# EAGLE design Pololu Magnetic Encoder (Floating) (AS5035) (EAGLE 6.4)
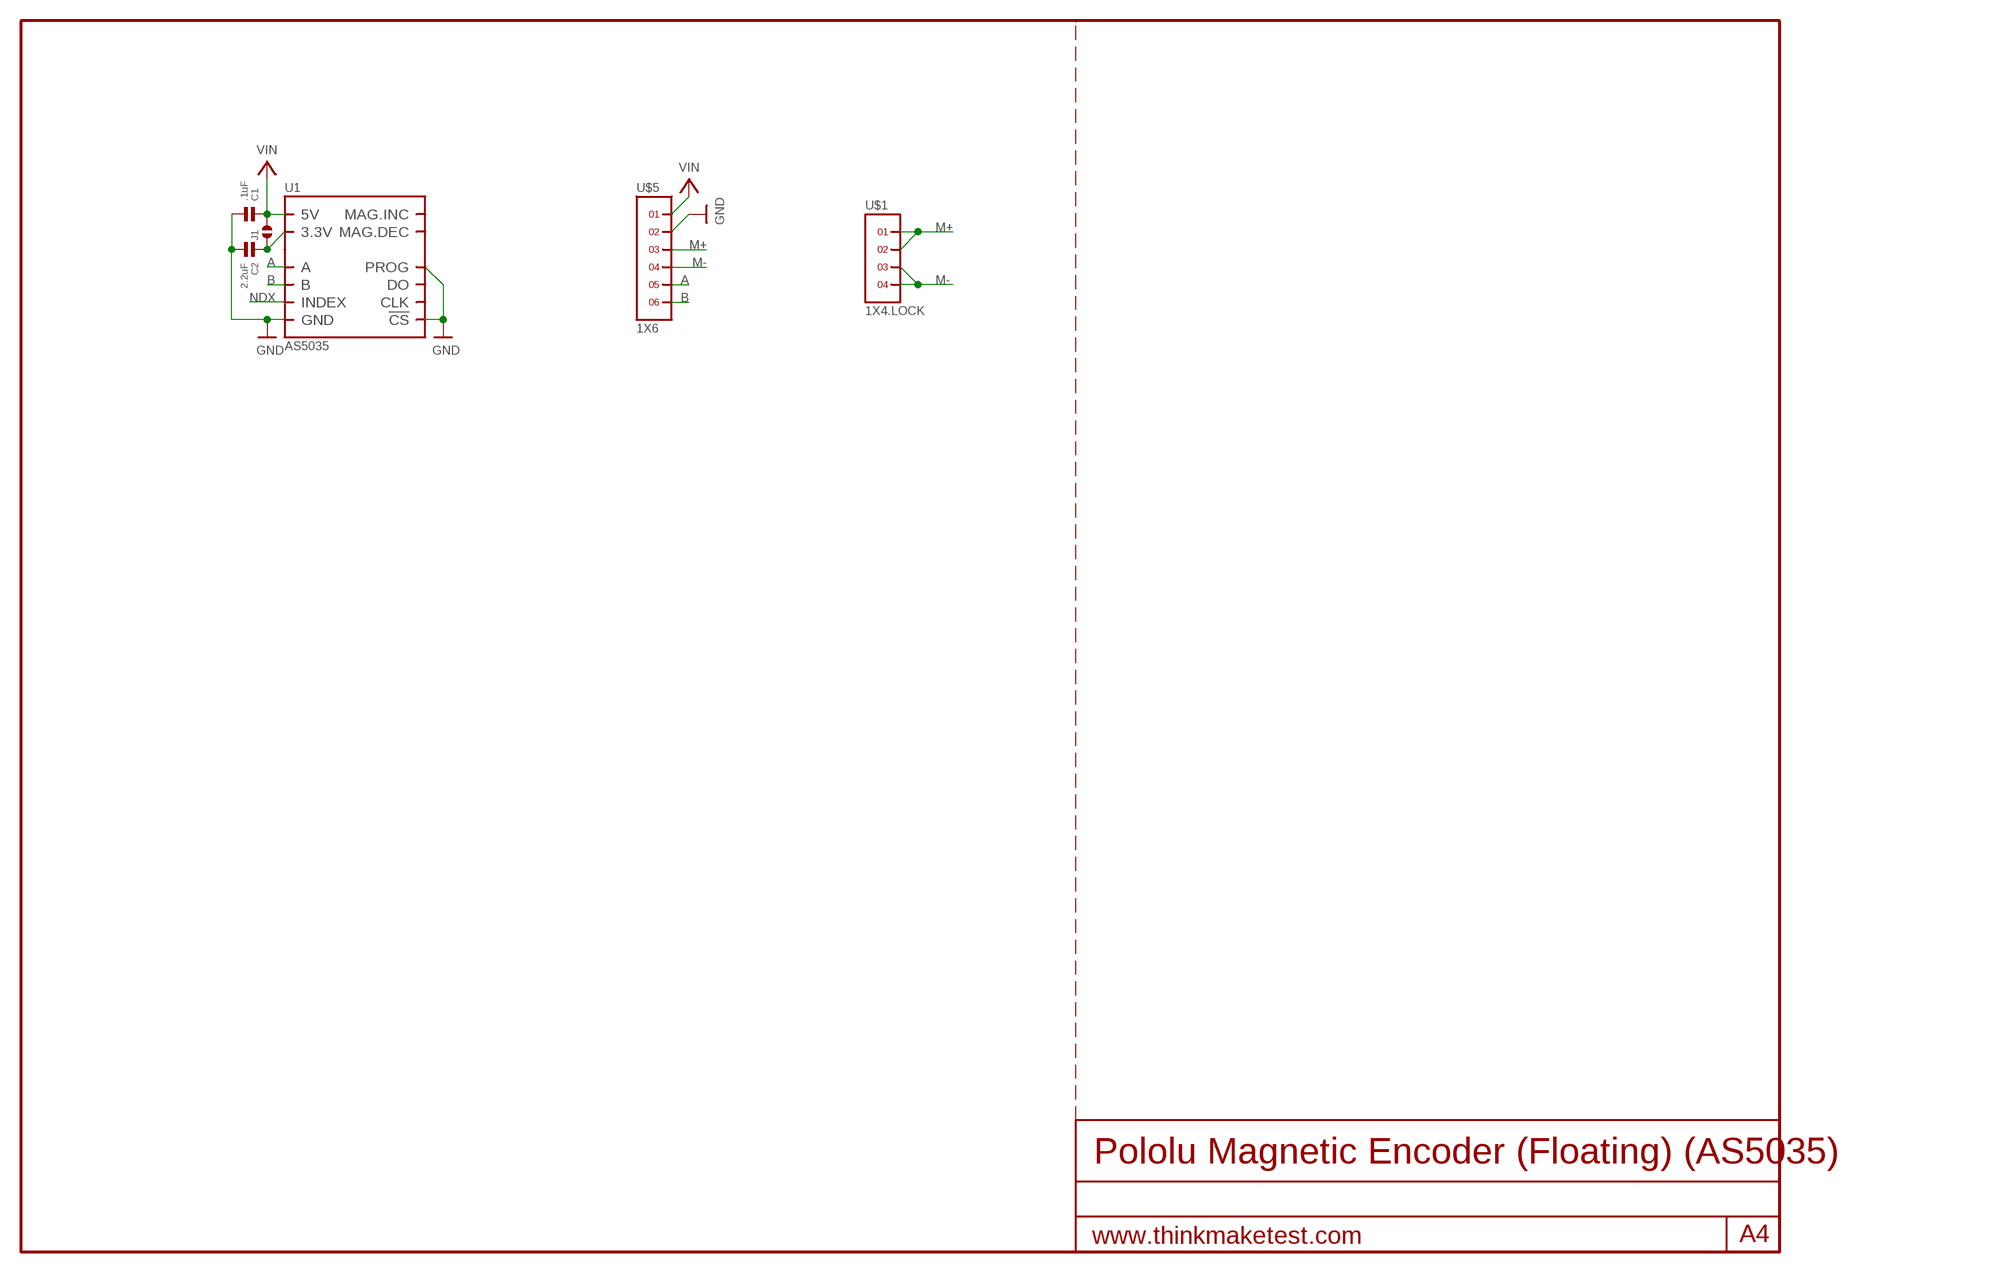
[diagram p0: schematic, sheet 1]

## Parts
C1  .1uF  CAPACITOR.0603  [0603]
C2  2.2uF  CAPACITOR.0603  [0603]
J1  SOLDERJUMPER.2.LRG.PASTE  [2.LRG.PASTE]
U1  AS5035  [SSOP16]
U$1  1X4.LOCK  [1X4.LOCK]
U$5  1X6  [1X6]

## Nets
A: U1.3(A) U$5.5
B: U1.4(B) U$5.6
GND: C1.2 C2.2 U1.7(GND) U1.8(PROG) U1.11(!CS) U$5.2
M+: U$1.1 U$1.2 U$5.3
M-: U$1.3 U$1.4 U$5.4
N$4: C2.1 J1.1 U1.15(3.3V)
NDX: U1.6(INDEX)
VIN: C1.1 J1.2 U1.16(5V) U$5.1
Unconnected: U1.1(MAG.INC) U1.2(MAG.DEC) U1.9(DO) U1.10(CLK)

## Library data of the parts
C1 C2 = .standardparts:CAPACITOR
J1 = .solderjumper:SOLDERJUMPER.2
U1 = austriamicrosystems:AS5035
U$1 = headers(.05in):1X4
U$5 = headers(2mm):1X6

## Board
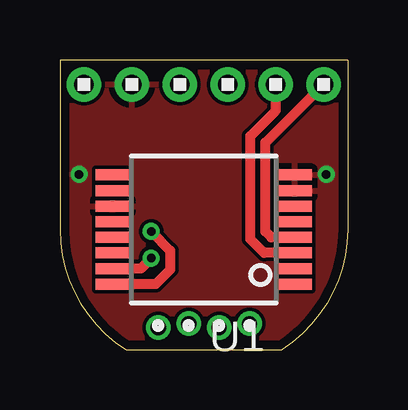
[diagram p1: board, top side]
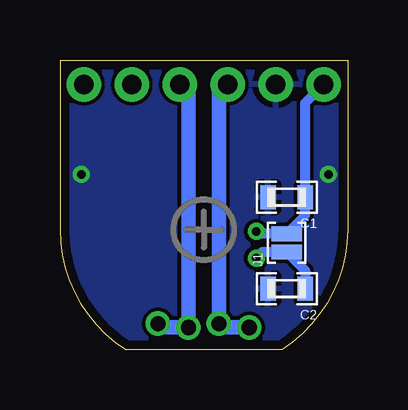
[diagram p2: board, bottom side, seen from below]

Size 12 x 12.06 mm. Coordinates in mm from the lower left corner, seen from the top.
Outline: 2.75,0 9.25,0 arc58 12,5 12,12.06 0,12.06 0,5 arc58 2.75,0
Copper layers (1*16): Top 0.0356mm / dielectric 1.5011mm / Bottom 0.0356mm
Design rules "OSHPark": minimum track width 6mil, minimum drill 13mil, track to track 6mil, track to pad 6mil, pad to pad 6mil, via to via 6mil, smd to smd 6mil, copper to edge 15mil, drill to drill 6mil, minimum pad ring 7mil, minimum via ring 7mil, stop-mask expansion 0mil, vias tented up to drill 16mil, thermal gap 10mil

### Footprints (pad centres in the part's own frame; a part is rotated, then mirrored left to right if it is on the bottom)
0603 = smd 0.65 x 1: 1 -0.775,0; 2 0.775,0
2.LRG.PASTE = smd 0.61 x 1.27: 1 -0.381,0; 2 0.381,0
SSOP16 = smd 0.46 x 1.43: 1 -2.275,-3.795; 2 -1.625,-3.795; 3 -0.975,-3.795; 4 -0.325,-3.795; 5 0.325,-3.795; 6 0.975,-3.795; 7 1.625,-3.795; 8 2.275,-3.795; 9 2.275,3.795; 10 1.625,3.795; 11 0.975,3.795; 12 0.325,3.795; 13 -0.325,3.795; 14 -0.975,3.795; 15 -1.625,3.795; 16 -2.275,3.795
1X4.LOCK = drill 0.635 pad 1.016: 1 0,-0.08; 2 1.27,0.08; 3 2.54,-0.08; 4 3.81,0.08
1X6 = drill 0.8 pad 1.422: 1 -5,0; 2 -3,0; 3 -1,0; 4 1,0; 5 3,0; 6 5,0

### Placement (x,y rotation side)
C1  2.54,6.35 180 bottom
C2  2.54,2.54 180 bottom
J1  2.54,4.45 90 bottom
U1  6,5 90 top
U$1  4.1,1 0 top
U$5  6,11.04 0 top

### Tracks (layer width: path | path; a pad name or v marks a point on that pad's centre or on a via)
A
  Top 0.406: U1.3 8.52,4.03 7.94,4.6 7.94,8.89 9,9.95 U$5.5
B
  Top 0.406: U1.4 8.82,4.67 8.57,4.92 8.57,8.62 U$5.6
GND  (via drill 0.36)
  other vias: 0.79,7.3 11.11,7.3
  pour Top: 0,0 12,0 12,12.06 0,12.06
  pour Bottom: 0,0 12,0 12,12.06 0,12.06
M+
  Bottom 0.61: U$1.1 5.21,0.92 U$1.2 5.37,10.68 U$5.3
M-
  Bottom 0.61: U$1.4 7.75,0.92 U$1.3 6.64,10.69 U$5.4
N$4  (via drill 0.36)
  Top 0.406: v3.81,3.81 3.38,3.38 U1.15
  Bottom 0.406: C2.1 1.76,3.29 J1.1 3.56,4.06 v3.81,3.81
VIN  (via drill 0.36)
  Top 0.406: v3.81,4.92 4.6,4.13 4.6,3.33 4,2.73 U1.16
  Bottom 0.406: U$5.1 1.76,10.28 C1.1 1.76,5.6 J1.2 3.71,4.83 v3.81,4.92

### Text on the board
tDocu: Cruz Monrreal II | AnomalousMaker.com
bDocu: VCC | GND | M+ | M- | A | B | 3.3v | Floating / QEI / Mag / Encoder